# EAGLE design TDR1 (EAGLE 9.2.2)
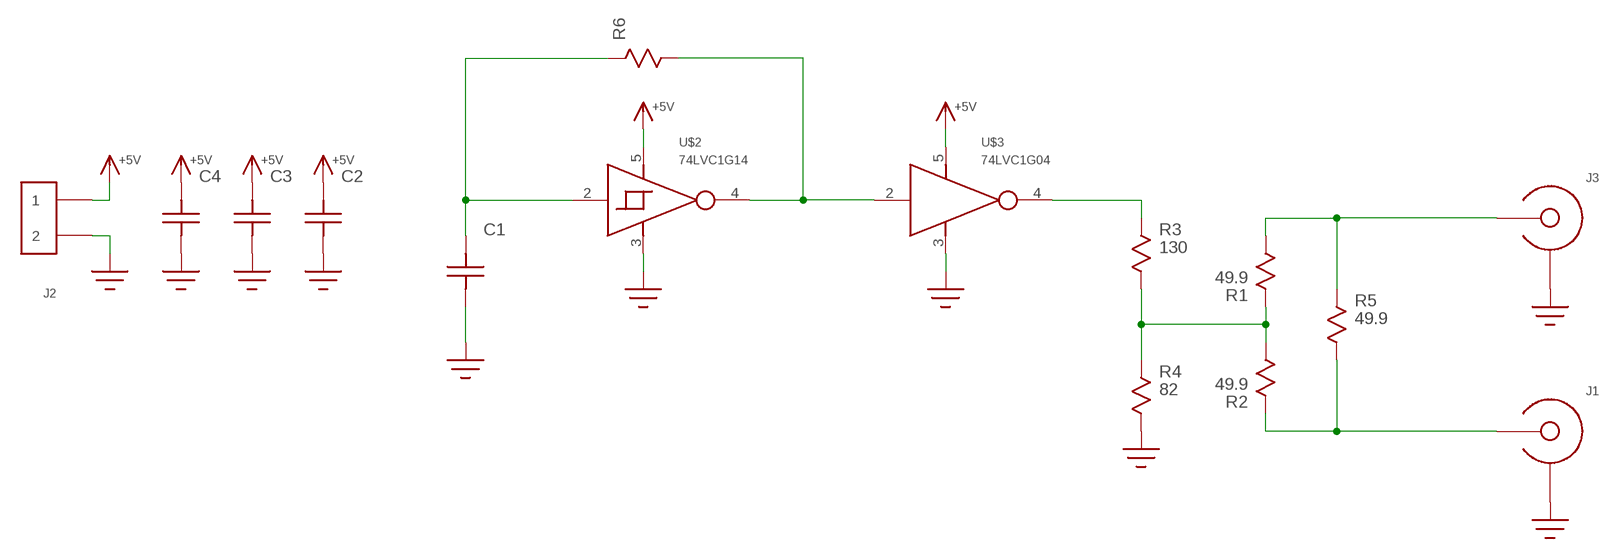
[diagram p0: schematic, sheet 1]

## Parts
C1  C0603  [C0603]
C2  C0603  [C0603]
C3  C0603  [C0603]
C4  C1206  [1206]
J1  BNC_MALE_PCB  [BNC_MALE_PCB]
J2  HEADER_2PIN  [HEADER_2PIN]
J3  EDGE_LAUNCH_JACK  [EDGE_LAUNCH_RF_CON]
R1  49.9  R0603  [R0603]
R2  49.9  R0603  [R0603]
R3  130  R0603  [R0603]
R4  82  R0603  [R0603]
R5  49.9  R0603  [R0603]
R6  R0603  [R0603]
U$2  74LVC1G14  [SOT23-5]
U$3  74LVC1G04  [SOT23-5]

## Nets
+5V: C2.P$2 C3.P$2 C4.P$2 J2.1 U$2.5(VCC) U$3.5(VCC)
GND: C1.P$1 C2.P$1 C3.P$1 C4.P$1 J1.SHIELD@1(SHIELD) J1.SHIELD@2(SHIELD) J1.SHIELD@3(SHIELD) J1.SHIELD@4(SHIELD) J2.2 J3.GND@1(SHIELD) J3.GND@2(SHIELD) J3.GND@3(SHIELD) J3.GND@4(SHIELD) J3.GND@5(SHIELD) J3.GND@6(SHIELD) J3.GND@7(SHIELD) J3.GND@8(SHIELD) J3.GND@9(SHIELD) J3.GND@10(SHIELD) J3.GND@11(SHIELD) J3.GND@12(SHIELD) J3.SHIELD@1(SHIELD) J3.SHIELD@2(SHIELD) R4.P$2 U$2.3(GND) U$3.3(GND)
N$1: C1.P$2 R6.P$1 U$2.2(IN)
N$2: R6.P$2 U$2.4(OUT) U$3.2(IN)
N$3: R1.P$1 R2.P$2 R3.P$2 R4.P$1
N$5: R3.P$1 U$3.4(OUT)
N$6: J3.CENTER R1.P$2 R5.P$1
N$7: J1.CENTER R2.P$1 R5.P$2

## Library data of the parts
C1-C4 = yapo:C
J1 = yapo:BNC_MALE_PCB
J2 = yapo:HEADER_2PIN
J3 = yapo:EDGE_LAUNCH_JACK
R1-R6 = yapo:R
U$2 = yapo:74LVC1G14
U$3 = yapo:74LVC1G04

## Board
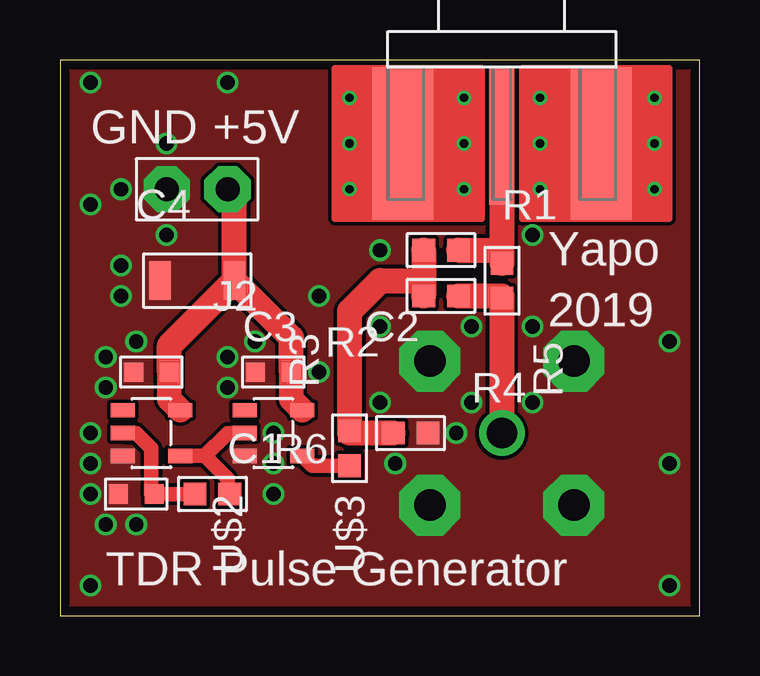
[diagram p1: board, top side]
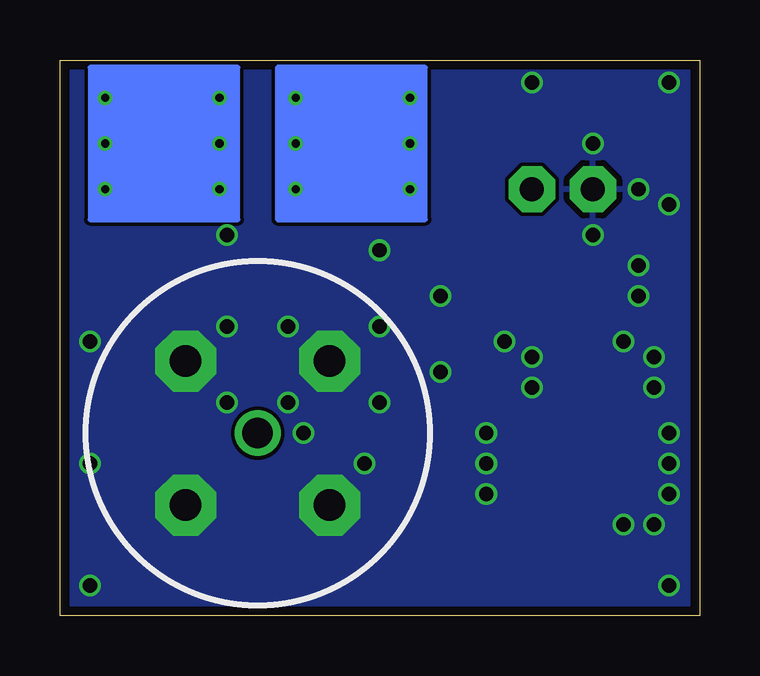
[diagram p2: board, bottom side, seen from below]

Size 26.65 x 23.16 mm. Coordinates in mm from the lower left corner, seen from the top.
Outline: 0,0 26.65,0 26.65,23.16 0,23.16 0,0
Copper layers (1*16): Top 0.035559375mm / dielectric 1.6mm / Bottom 0.035559375mm
Design rules "oshpark-2layer *": minimum track width 6mil, minimum drill 10mil, track to track 6mil, track to pad 6mil, pad to pad 6mil, via to via 6mil, smd to smd 6mil, copper to edge 15mil, drill to drill 6mil, minimum pad ring 5mil, minimum via ring 5mil, stop-mask expansion 2.5mil, vias tented up to drill 30mil, thermal gap 10mil

### Footprints (pad centres in the part's own frame; a part is rotated, then mirrored left to right if it is on the bottom)
C0603 = smd 0.8 x 0.8: P$1 -0.75,0; P$2 0.75,0
1206 = smd 0.9 x 1.6: P$1 -1.55,0; P$2 1.55,0
BNC_MALE_PCB = drill 1.27 pad 1.778: CENTER 0,0 | drill 1.321 pad 2.54 octagon: SHIELD@1 -3,-3; SHIELD@2 -3,3; SHIELD@3 3,3; SHIELD@4 3,-3
HEADER_2PIN = drill 1 pad 1.93 octagon: 1 -1.27,0; 2 1.27,0
EDGE_LAUNCH_RF_CON = smd 5.715 x 1.041: CENTER -2.875,0 | drill 0.35: GND@1 -5.08,1.587; GND@2 -3.175,1.587; GND@3 -1.27,1.587; GND@4 -5.08,-1.587; GND@5 -3.175,-1.587; GND@6 -1.27,-1.587; GND@7 -5.08,6.35; GND@8 -3.175,6.35; GND@9 -1.27,6.35; GND@10 -5.08,-6.35; GND@11 -3.175,-6.35; GND@12 -1.27,-6.35 | smd 6.35 x 2.54: SHIELD@1 -3.175,-4.128; SHIELD@2 -3.175,4.128
R0603 = smd 0.95 x 0.95: P$1 -0.725,0; P$2 0.725,0
SOT23-5 = smd 0.6 x 1: 1 -0.95,-1.2; 2 0,-1.2; 3 0.95,-1.2; 4 0.95,1.2; 5 -0.95,1.2

### Placement (x,y rotation side)
C1  3.17,5.08 0 top
C2  8.89,10.16 0 top
C3  3.81,10.16 0 top
C4  5.71,13.97 0 top
J1  18.41,7.62 0 top
J2  5.71,17.78 180 top
J3  18.41,22.86 90 top
R1  15.88,15.24 0 top
R2  15.88,13.34 180 top
R3  12.06,6.99 90 top
R4  14.61,7.62 0 top
R5  18.41,13.97 270 top
R6  6.35,5.08 0 top
U$2  3.81,7.62 270 top
U$3  8.89,7.62 270 top

### Tracks (layer width: path | path; a pad name or v marks a point on that pad's centre or on a via)
+5V
  Top 1.016: C3.P$2 4.56,9.02 U$2.5 | C2.P$2 9.64,9.02 U$3.5
  Top 1.041: C2.P$2 9.64,11.6 C4.P$2 | C3.P$2 4.56,11.27 C4.P$2 | C4.P$2 7.26,17.5 J2.1
GND  (via drill 0.6)
  other vias: 1.27,1.27 1.91,10.79 1.91,9.53 3.17,3.81 1.91,3.81 2.54,14.61 2.54,13.34 6.99,10.79 6.99,9.53 19.68,15.88 19.68,12.06 13.34,15.24 13.34,12.06 10.79,13.34 10.79,10.16 13.34,8.89 17.14,8.89 17.14,12.06 19.68,8.89 1.27,22.23 25.4,1.27 25.4,6.35 25.4,11.43 6.99,22.23 1.27,17.14 8.89,6.35 8.89,5.08 1.27,7.62 1.27,5.08 1.27,6.35 8.89,7.62 3.17,11.43 8.13,11.43 4.45,15.88 2.54,17.78 4.45,19.68 16.51,7.62 13.97,6.35
  pour Top (no thermals): 0,0 26.67,0 26.67,22.86 0,22.86
  pour Bottom: 0,0 26.67,0 26.67,22.86 0,22.86
N$1
  Top 0.61: R6.P$1 C1.P$2 3.81,5.08 3.81,6.99 3.17,7.62 U$2.2
N$2
  Top 0.61: U$2.4 6.04,6.67 | 6.04,6.67 6.99,7.62 U$3.2 | R6.P$2 6.99,5.17 6.99,5.72 6.04,6.67
N$3
  Top 1.041: R1.P$1 15.15,13.97 | 15.15,13.97 R2.P$2 | R4.P$1 12.06,7.62 R3.P$2 12.06,12.7 13.34,13.97 15.15,13.97
N$5
  Top 0.61: U$3.4 10.5,6.26 R3.P$1
N$6
  Top 1.041: J3.CENTER 18.41,15.24 | 18.41,15.24 R5.P$1 | R1.P$2 18.41,15.24
N$7
  Top 1.041: J1.CENTER R5.P$2 18.41,13.34 R2.P$1

### Text on the board
tPlace: GND | +5V | Yapo | 2019 | TDR Pulse Generator